# EasyEDA schematic share.json
TITLE: rapoukTestBoardv0; REV: 0.0; Date: 28-04-24; Sheet: 1/1; Drawn By: Roman Suk; Company: Suk Industries
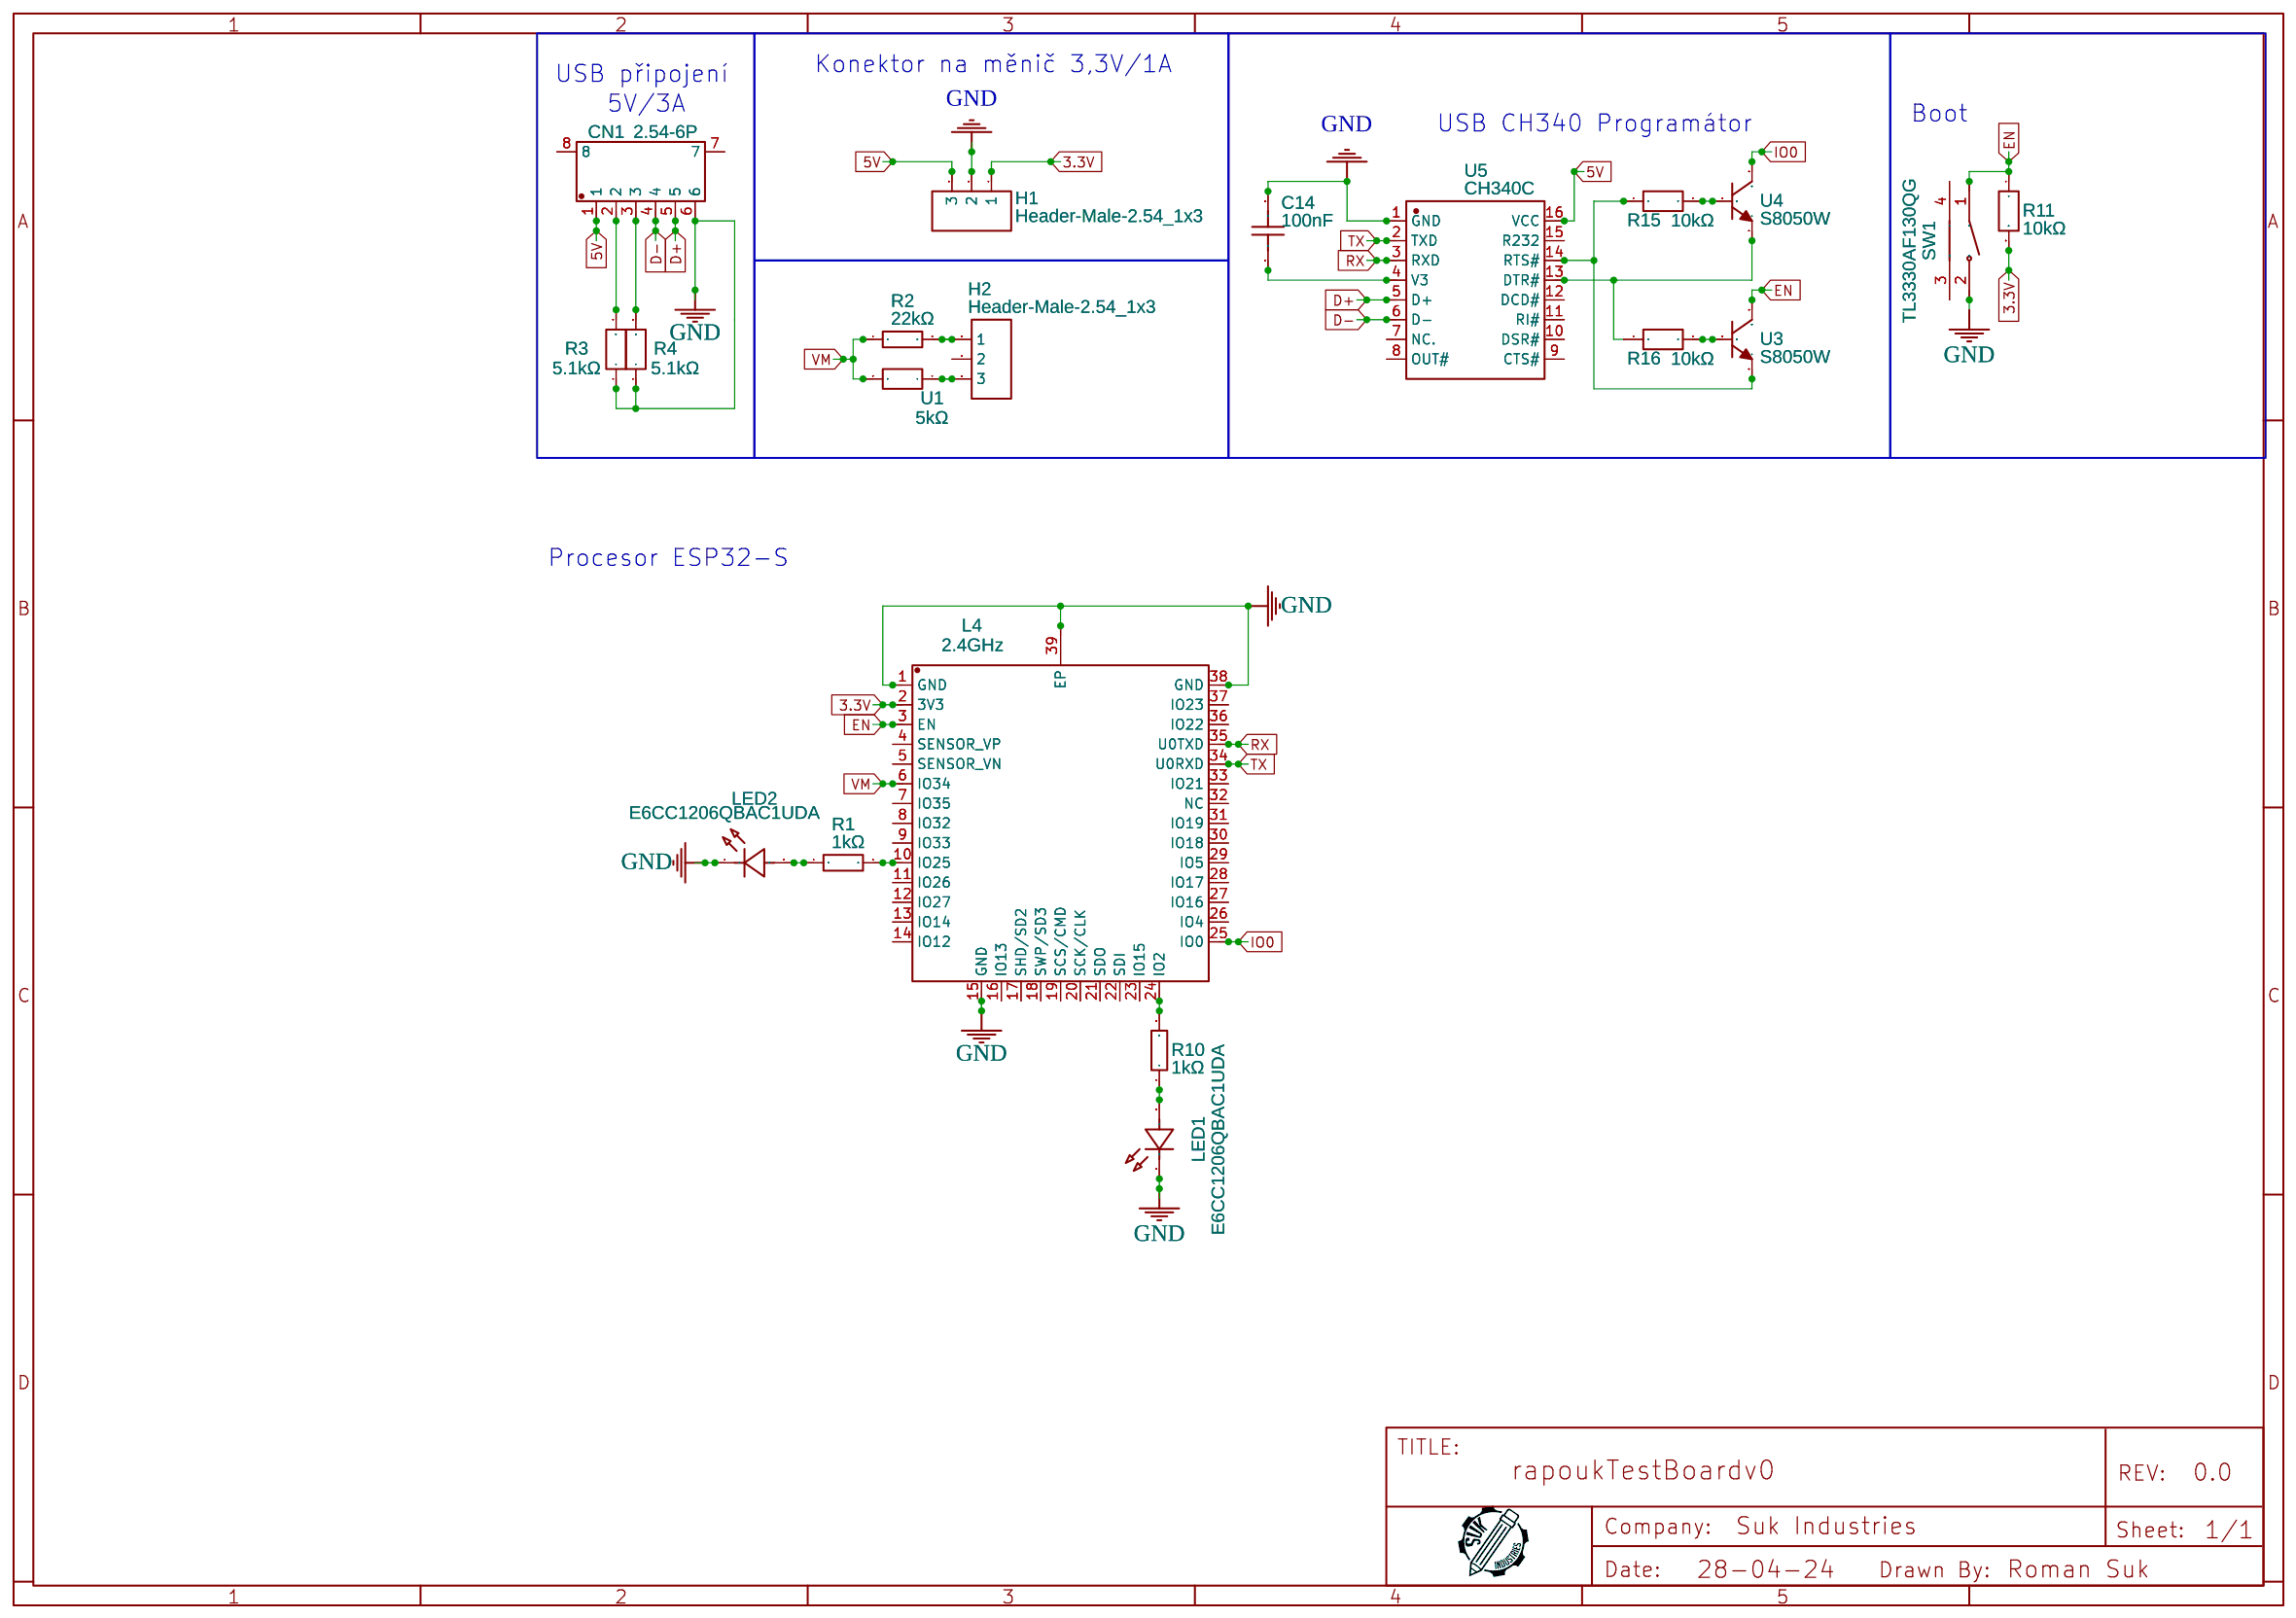
[diagram p0: schematic sheet]

## Parts
C14  100nF  [C1206]
CN1  2.54-6P  [CONN-SMD_2.54-6P]
H1  Header-Male-2.54_1x3  [HDR-TH_3P-P2.54-V-M-1]
H2  Header-Male-2.54_1x3  [HDR-TH_3P-P2.54-V-M-1]
L4  2.4GHz  [WIRELM-SMD_ESP32-S]
LED1  E6CC1206QBAC1UDA  [LED1206-RD_BLUE-GH_E6CC1206QBAC1UDA]
LED2  E6CC1206QBAC1UDA  [LED1206-RD_BLUE-GH_E6CC1206QBAC1UDA]
R1  1kΩ  [R1206]
R2  22kΩ  [R1206]
R3  5.1kΩ  [R0603]
R4  5.1kΩ  [R0603]
R10  1kΩ  [R1206]
R11  10kΩ  [R1206]
R15  10kΩ  [R1206]
R16  10kΩ  [R1206]
SW1  TL3330AF130QG  [SW-SMD_E-SWITCH_TL3330]
U1  5kΩ  [R1206]
U3  S8050W  [SOT-323-3_L2.1-W1.3-P1.30-LS2.3-BR]
U4  S8050W  [SOT-323-3_L2.1-W1.3-P1.30-LS2.3-BR]
U5  CH340C  [SOP-16_L10.0-W3.9-P1.27-LS6.0-BL]

## Library data of the parts
C14 = 1206Y1000104KXR: Contributor: LCSC; Supplier: LCSC; Supplier Part: C2319128; Manufacturer: Knowles(楼氏); JLCPCB Part Class: Extended Part
CN1 = 2.54-6P: Contributor: LCSC; Supplier: LCSC; Supplier Part: C146122; Manufacturer: BOOMELE(博穆精密); Manufacturer Part: XH-6P卧贴; JLCPCB Part Class: Extended Part
H1 H2 = Header-Male-2.54_1x3: Supplier: LCSC; Manufacturer: BOOMELE(博穆精密); Manufacturer Part: 2.54-1*3P针; Supplier Part: C49257; JLCPCB Part Class: Extended Part
L4 = ESP32-S(16MB): Contributor: lcsc; Supplier: LCSC; Supplier Part: C2991923; Manufacturer: Ai-Thinker(安信可); JLCPCB Part Class: Extended Part
LED1 LED2 = E6CC1206QBAC1UDA: Contributor: LCSC; Supplier: LCSC; Supplier Part: C375563; Manufacturer: ekinglux(亿晶源); JLCPCB Part Class: Extended Part
R1 R10 = CR1206-FX-1001ELF: Contributor: LCSC; Supplier: LCSC; Supplier Part: C205045; Manufacturer: BOURNS; JLCPCB Part Class: Extended Part
R2 = AECR1206F22K0K9: Contributor: LCSC; Supplier: LCSC; Supplier Part: C352116; Manufacturer: RESI(开步睿思）; JLCPCB Part Class: Extended Part
R3 R4 = FRC0603F5101TS: Contributor: lcsc; Supplier: LCSC; Supplier Part: C2907044; Manufacturer: FOJAN(富捷); JLCPCB Part Class: Extended Part
R11 R15 R16 = SCR1206F10K: Supplier: LCSC; Supplier Part: C3017025; Manufacturer: VO(翔胜); JLCPCB Part Class: Extended Part; Contributor: lcsc
SW1 = TL3330AF130QG: Contributor: LCSC; Supplier: LCSC; Supplier Part: C2886885; Manufacturer: E-Switch; JLCPCB Part Class: Extended Part
U1 = HVF1206T5001FE: Contributor: lcsc; Supplier: LCSC; Supplier Part: C4194063; Manufacturer: Ohmite
U3 U4 = S8050W: Contributor: lcsc; Supplier: LCSC; Supplier Part: C5186011; Manufacturer: Slkor(萨科微)
U5 = CH340C: Supplier: LCSC; Manufacturer: WCH(南京沁恒); Supplier Part: C84681; JLCPCB Part Class: Extended Part

## Nets
3.3V: H1.1 L4.2(3V3) R11.2
5V: CN1.1 H1.3 U5.16(VCC)
GND: C14.2 CN1.6 H1.2 L4.1(GND) L4.15(GND) L4.38(GND) L4.39(EP) LED1.1(K) LED2.1(K) R3.1 R4.1 SW1.2 U5.1(GND)
D+: CN1.5 U5.5(D+)
D-: CN1.4 U5.6(D-)
EN: L4.3(EN) R11.1 SW1.1 U3.3(C)
IO0: L4.25(IO0) U4.3(C)
RX: L4.35(U0TXD) U5.3(RXD)
TX: L4.34(U0RXD) U5.2(TXD)
VM: L4.6(IO34) R2.1 U1.2
Net-(C14-1): C14.1 U5.4(V3)
Net-(CN1-2): CN1.2 R3.2
Net-(CN1-3): CN1.3 R4.2
Net-(H2-1): H2.1 R2.2
Net-(H2-3): H2.3 U1.1
Net-(L4-10): L4.10(IO25) R1.2
Net-(L4-24): L4.24(IO2) R10.2
Net-(LED1-2): LED1.2(A) R10.1
Net-(LED2-2): LED2.2(A) R1.1
Net-(R15-1): R15.1 U3.2(E) U5.14(RTS#)
Net-(R15-2): R15.2 U4.1(B)
Net-(R16-1): R16.1 U4.2(E) U5.13(DTR#)
Net-(R16-2): R16.2 U3.1(B)

Not connected (* = marked no-connect by the designer): CN1 7 8; H2 2; L4 4(SENSOR_VP) 5(SENSOR_VN) 7(IO35) 8(IO32) 9(IO33) 11(IO26) 12(IO27) 13(IO14) 14(IO12) 16(IO13) 17(SHD/SD2) 18(SWP/SD3) 19(SCS/CMD) 20(SCK/CLK) 21(SDO) 22(SDI) 23(IO15) 26(IO4) 27(IO16) 28(IO17) 29(IO5) 30(IO18) 31(IO19) 32(NC) 33(IO21) 36(IO22) 37(IO23); SW1 3 4; U5 7(NC.) 8(OUT#) 9(CTS#) 10(DSR#) 11(RI#) 12(DCD#) 15(R232)

## Notes on the sheet
- USB připojení
- Konektor na měnič 3,3V/1A
- 5V/3A
- USB CH340 Programátor
- Boot
- Procesor ESP32-S
